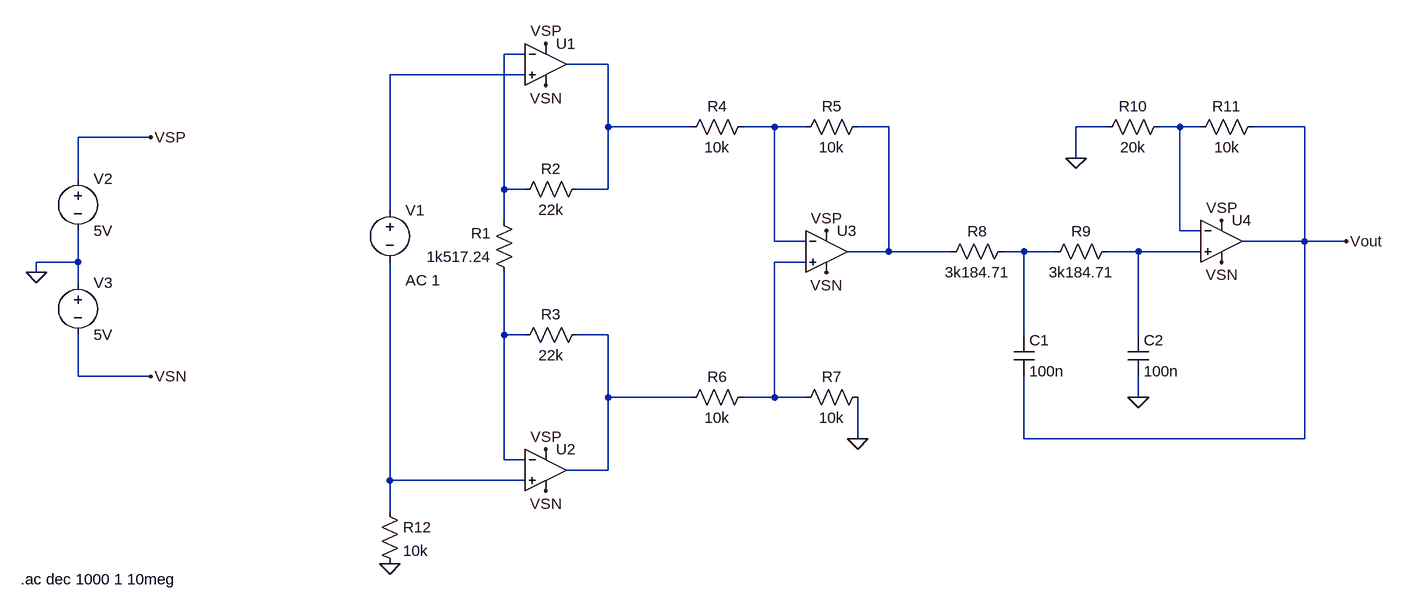
[diagram p0: schematic Dr5.asc]
Dr5.asc, the LTspice schematic file:
Version 4
SHEET 1 1768 680
WIRE 432 -176 400 -176
WIRE 560 -160 496 -160
WIRE 432 -144 224 -144
WIRE 560 -64 560 -160
WIRE 688 -64 560 -64
WIRE 816 -64 768 -64
WIRE 864 -64 816 -64
WIRE 992 -64 944 -64
WIRE 1328 -64 1280 -64
WIRE 1440 -64 1408 -64
WIRE 1472 -64 1440 -64
WIRE 1632 -64 1552 -64
WIRE -144 -48 -256 -48
WIRE 1280 -16 1280 -64
WIRE -256 16 -256 -48
WIRE 400 32 400 -176
WIRE 432 32 400 32
WIRE 560 32 560 -64
WIRE 560 32 512 32
WIRE 224 64 224 -144
WIRE 400 80 400 32
WIRE 1440 96 1440 -64
WIRE 1472 96 1440 96
WIRE 816 112 816 -64
WIRE 864 112 816 112
WIRE 1632 112 1632 -64
WIRE 1632 112 1536 112
WIRE 1696 112 1632 112
WIRE 992 128 992 -64
WIRE 992 128 928 128
WIRE 1088 128 992 128
WIRE 1200 128 1168 128
WIRE 1248 128 1200 128
WIRE 1376 128 1328 128
WIRE 1472 128 1376 128
WIRE -256 144 -256 96
WIRE -256 144 -320 144
WIRE 864 144 816 144
WIRE -320 160 -320 144
WIRE -256 176 -256 144
WIRE 400 256 400 160
WIRE 432 256 400 256
WIRE 560 256 512 256
WIRE 1200 256 1200 128
WIRE 1376 256 1376 128
WIRE -256 320 -256 256
WIRE -144 320 -256 320
WIRE 560 352 560 256
WIRE 688 352 560 352
WIRE 816 352 816 144
WIRE 816 352 768 352
WIRE 864 352 816 352
WIRE 1376 352 1376 320
WIRE 944 416 944 352
WIRE 1200 416 1200 320
WIRE 1632 416 1632 112
WIRE 1632 416 1200 416
WIRE 400 448 400 256
WIRE 432 448 400 448
WIRE 560 464 560 352
WIRE 560 464 496 464
WIRE 224 480 224 144
WIRE 432 480 224 480
WIRE 224 528 224 480
FLAG -320 160 0
FLAG 224 608 0
FLAG 944 416 0
FLAG 464 -192 VSP
FLAG -144 -48 VSP
FLAG 464 432 VSP
FLAG -144 320 VSN
FLAG 464 -128 VSN
FLAG 464 496 VSN
FLAG 896 160 VSN
FLAG 896 96 VSP
FLAG 1376 352 0
FLAG 1280 -16 0
FLAG 1504 80 VSP
FLAG 1504 144 VSN
FLAG 1696 112 Vout
SYMBOL voltage -256 0 R0
SYMATTR InstName V2
SYMATTR Value 5V
SYMBOL voltage -256 160 R0
SYMATTR InstName V3
SYMATTR Value 5V
SYMBOL voltage 224 48 R0
WINDOW 123 24 124 Left 2
WINDOW 39 0 0 Left 2
SYMATTR Value2 AC 1
SYMATTR InstName V1
SYMATTR Value ""
SYMBOL Opamps\\UniversalOpamp2 464 -160 R0
SYMATTR InstName U1
SYMBOL res 208 512 R0
SYMATTR InstName R12
SYMATTR Value 10k
SYMBOL Opamps\\UniversalOpamp2 464 464 R0
SYMATTR InstName U2
SYMBOL res 528 16 R90
WINDOW 0 0 56 VBottom 2
WINDOW 3 32 56 VTop 2
SYMATTR InstName R2
SYMATTR Value 22k
SYMBOL res 528 240 R90
WINDOW 0 0 56 VBottom 2
WINDOW 3 32 56 VTop 2
SYMATTR InstName R3
SYMATTR Value 22k
SYMBOL res 416 176 R180
WINDOW 0 36 76 Left 2
WINDOW 3 36 40 Left 2
SYMATTR InstName R1
SYMATTR Value 1k517.24
SYMBOL res 784 -80 R90
WINDOW 0 0 56 VBottom 2
WINDOW 3 32 56 VTop 2
SYMATTR InstName R4
SYMATTR Value 10k
SYMBOL res 784 336 R90
WINDOW 0 0 56 VBottom 2
WINDOW 3 32 56 VTop 2
SYMATTR InstName R6
SYMATTR Value 10k
SYMBOL res 960 336 R90
WINDOW 0 0 56 VBottom 2
WINDOW 3 32 56 VTop 2
SYMATTR InstName R7
SYMATTR Value 10k
SYMBOL Opamps\\UniversalOpamp2 896 128 R0
SYMATTR InstName U3
SYMBOL res 960 -80 R90
WINDOW 0 0 56 VBottom 2
WINDOW 3 32 56 VTop 2
SYMATTR InstName R5
SYMATTR Value 10k
SYMBOL res 1184 112 R90
WINDOW 0 0 56 VBottom 2
WINDOW 3 32 56 VTop 2
SYMATTR InstName R8
SYMATTR Value 3k184.71
SYMBOL res 1344 112 R90
WINDOW 0 0 56 VBottom 2
WINDOW 3 32 56 VTop 2
SYMATTR InstName R9
SYMATTR Value 3k184.71
SYMBOL cap 1184 256 R0
SYMATTR InstName C1
SYMATTR Value 100n
SYMBOL cap 1360 256 R0
SYMATTR InstName C2
SYMATTR Value 100n
SYMBOL Opamps\\UniversalOpamp2 1504 112 R0
SYMATTR InstName U4
SYMBOL res 1568 -80 R90
WINDOW 0 0 56 VBottom 2
WINDOW 3 32 56 VTop 2
SYMATTR InstName R11
SYMATTR Value 10k
SYMBOL res 1424 -80 R90
WINDOW 0 0 56 VBottom 2
WINDOW 3 32 56 VTop 2
SYMATTR InstName R10
SYMATTR Value 20k
TEXT -344 632 Left 2 !.ac dec 1000 1 10meg

The netlist it stands for:
* Dr5.asc
V2 VSP 0 5V
V3 0 VSN 5V
V1 N003 N012 AC 1
XU1 N003 N001 VSP VSN N002 level.2 Avol=1Meg GBW=10Meg Slew=10Meg ilimit=25m rail=0 Vos=0 phimargin=45 en=0 enk=0 in=0 ink=0 Rin=500Meg  ; pins IN+ IN- V+ V- OUT
R12 N012 0 10k
XU2 N012 N010 VSP VSN N011 level.2 Avol=1Meg GBW=10Meg Slew=10Meg ilimit=25m rail=0 Vos=0 phimargin=45 en=0 enk=0 in=0 ink=0 Rin=500Meg  ; pins IN+ IN- V+ V- OUT
R2 N002 N001 22k
R3 N011 N010 22k
R1 N010 N001 1k517.24
R4 N004 N002 10k
R6 N009 N011 10k
R7 0 N009 10k
XU3 N009 N004 VSP VSN N005 level.2 Avol=1Meg GBW=10Meg Slew=10Meg ilimit=25m rail=0 Vos=0 phimargin=45 en=0 enk=0 in=0 ink=0 Rin=500Meg  ; pins IN+ IN- V+ V- OUT
R5 N005 N004 10k
R8 N007 N005 3k184.71
R9 N008 N007 3k184.71
C1 N007 Vout 100n
C2 N008 0 100n
XU4 N008 N006 VSP VSN Vout level.2 Avol=1Meg GBW=10Meg Slew=10Meg ilimit=25m rail=0 Vos=0 phimargin=45 en=0 enk=0 in=0 ink=0 Rin=500Meg  ; pins IN+ IN- V+ V- OUT
R11 Vout N006 10k
R10 N006 0 20k
.ac dec 1000 1 10meg
.lib UniversalOpamps2.sub
.backanno
.end